# EAGLE schematic pcb-exp-ctrl (EAGLE 6.4)
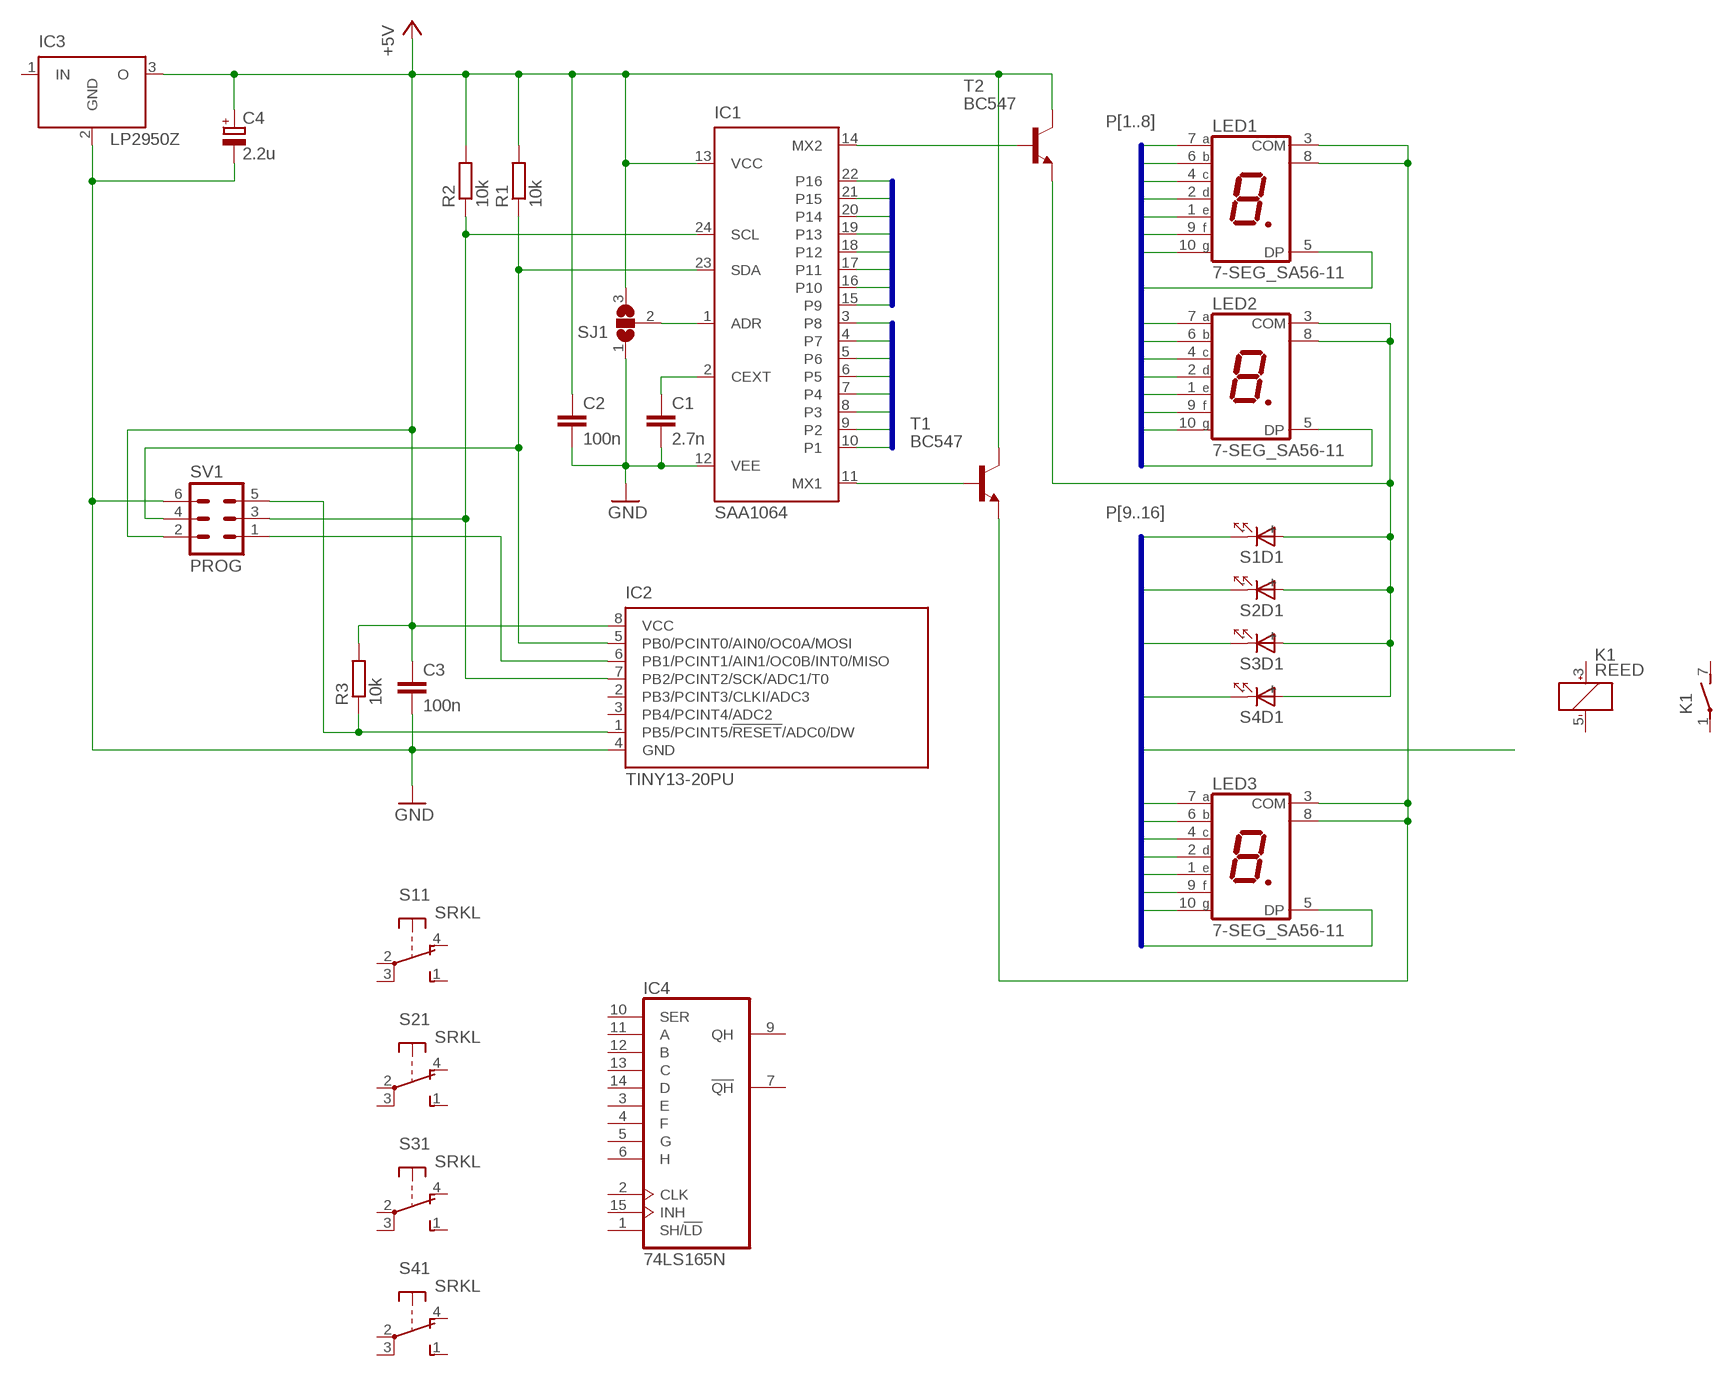
[diagram p0: schematic, sheet 1]

## Parts
C1  2.7n  C-EU025-025X050  [C025-025X050]
C2  100n  C-EU025-025X050  [C025-025X050]
C3  100n  C-EU025-025X050  [C025-025X050]
C4  2.2u  CPOL-EUE2.5-6  [E2,5-6]
IC1  SAA1064  [DIL24-6]
IC2  TINY13-20PU  [DIL08]
IC3  LP2950Z  [TO92]
IC4  74LS165N  [DIL16]
K1  REED  [REED]
LED1  7-SEG_SA56-11  [SA56-11]
LED2  7-SEG_SA56-11  [SA56-11]
LED3  7-SEG_SA56-11  [SA56-11]
R1  10k  R-EU_0204/7  [0204/7]
R2  10k  R-EU_0204/7  [0204/7]
R3  10k  R-EU_0204/7  [0204/7]
S1  SRKL  [SRKL]
S2  SRKL  [SRKL]
S3  SRKL  [SRKL]
S4  SRKL  [SRKL]
SJ1  SJ2W  [SJ_2]
SV1  PROG  ML6  [ML6]
T1  BC547  [TO92]
T2  BC547  [TO92]

## Nets
+5V: C2.1 C3.1 C4.+ IC1.13(VCC) IC2.8(VCC) IC3.3(O) R1.2 R2.2 R3.2 SJ1.3 SV1.2 T1.3(C) T2.3(C)
_RESET: IC2.1(PB5/PCINT5/!RESET!/ADC0/DW) R3.1 SV1.5
GND: C1.2 C2.2 C3.2 C4.- IC1.12(VEE) IC2.4(GND) IC3.2(GND) SJ1.1 SV1.6
MISO: IC2.6(PB1/PCINT1/AIN1/OC0B/INT0/MISO) SV1.1
MOSI: IC1.23(SDA) IC2.5(PB0/PCINT0/AIN0/OC0A/MOSI) R1.1 SV1.4
N$2: LED2.3(COM) LED2.8(COM) S1.+(D1:A) S2.+(D1:A) S3.+(D1:A) S4.+(D1:A) T2.1(E)
N$5: C1.1 IC1.2(CEXT)
N$6: IC1.1(ADR) SJ1.2
N$7: LED1.3(COM) LED1.8(COM) LED3.3(COM) LED3.8(COM) T1.1(E)
N$8: IC1.11(MX1) T1.2(B)
N$10: IC1.14(MX2) T2.2(B)
P1: IC1.10(P1) LED1.7(A) LED2.7(A)
P2: IC1.9(P2) LED1.6(B) LED2.6(B)
P3: IC1.8(P3) LED1.4(C) LED2.4(C)
P4: IC1.7(P4) LED1.2(D) LED2.2(D)
P5: IC1.6(P5) LED1.1(E) LED2.1(E)
P6: IC1.5(P6) LED1.9(F) LED2.9(F)
P7: IC1.4(P7) LED1.10(G) LED2.10(G)
P8: IC1.3(P8) LED1.5(DP) LED2.5(DP)
P9: IC1.15(P9) LED3.7(A) S1.-(D1:C)
P10: IC1.16(P10) LED3.6(B) S2.-(D1:C)
P11: IC1.17(P11) LED3.4(C) S3.-(D1:C)
P12: IC1.18(P12) LED3.2(D) S4.-(D1:C)
P13: IC1.19(P13) LED3.1(E)
P14: IC1.20(P14) LED3.9(F)
P15: IC1.21(P15) LED3.10(G)
P16: IC1.22(P16) LED3.5(DP)
SCK: IC1.24(SCL) IC2.7(PB2/PCINT2/SCK/ADC1/T0) R2.1 SV1.3
Unconnected: IC2.2(PB3/PCINT3/CLKI/ADC3) IC2.3(PB4/PCINT4/ADC2) IC3.1(IN) IC4.1(SH/!LD) IC4.2(CLK) IC4.3(E) IC4.4(F) IC4.5(G) IC4.6(H) IC4.7(!QH) IC4.9(QH) IC4.10(SER) IC4.11(A) IC4.12(B) IC4.13(C) IC4.14(D) IC4.15(INH) K1.1(2:P) K1.3(1:+) K1.5(1:-) K1.7(2:S) S1.1(1:S) S1.2(1:P) S1.3(1:P) S1.4(1:O) S2.1(1:S) S2.2(1:P) S2.3(1:P) S2.4(1:O) S3.1(1:S) S3.2(1:P) S3.3(1:P) S3.4(1:O) S4.1(1:S) S4.2(1:P) S4.3(1:P) S4.4(1:O)

## Buses
P[1..8]
P[9..16]

## Power pins joined to a net without a drawn wire
GND: IC4.8(GND)
VCC: IC4.16(VCC)

## Library data of the parts
C1-C3 = rcl:C-EU: CAPACITOR, European symbol
C4 = rcl:CPOL-EU: POLARIZED CAPACITOR, European symbol
IC1 = micro-philips:SAA1064: I2C-Bus 4-digit LED-DRIVER; MPN: SAA1064/N2,112; OC_FARNELL: 1627002; OC_NEWARK: 70R8646
IC2 = atmel:TINY13: 8-bit AVR Microcontroller with 1K Bytes In-System Programmable Flash Source: http://www.atmel.com/dyn/resources/prod_documents/2535S.pdf; MPN: ATTINY13-20PU; OC_FARNELL: 9171550; OC_NEWARK: 96K6521
IC3 = national-semiconductor:LP2950: Adjustable Micropower Voltage Regulator Source: http://www.national.com/ds/LP/LP2950.pdf; MF: NATIONAL SEMICONDUCTOR; MPN: LP2950CZ-5.0/NOPB; OC_FARNELL: 1150320; OC_NEWARK: 41K6545
IC4 = 74xx-eu:74*165: 8-bit parallel load SHIFT REGISTER
K1 = relay:REED: RELAY reed, 1 x norm. open with polarity, grid 5.08; OC_FARNELL: unknown; OC_NEWARK: unknown
LED1-LED3 = display-kingbright:7-SEG_: Kingbright 14.2mm (0.56 INCH) SINGLE DIGIT NUMERIC DUISPLAY Source: SA56-11EWA(Ver1189471036.pdf; OC_FARNELL: unknown; OC_NEWARK: unknown
R1-R3 = rcl:R-EU_: RESISTOR, European symbol
S1-S4 = switch-misc:SRKL: SWITCH
SJ1 = jumper:SJ2W: SMD solder JUMPER
SV1 = con-ml:ML6: HARTING; OC_FARNELL: unknown; OC_NEWARK: unknown
T1 T2 = transistor:BC547: NPN TRANSISTOR